# Altium project PLC_Controller Card.PrjPcb (part 2 of 2)

## Sheet Power_supply.SchDoc
size A4; SheetNumber: 7; SheetTotal: 9
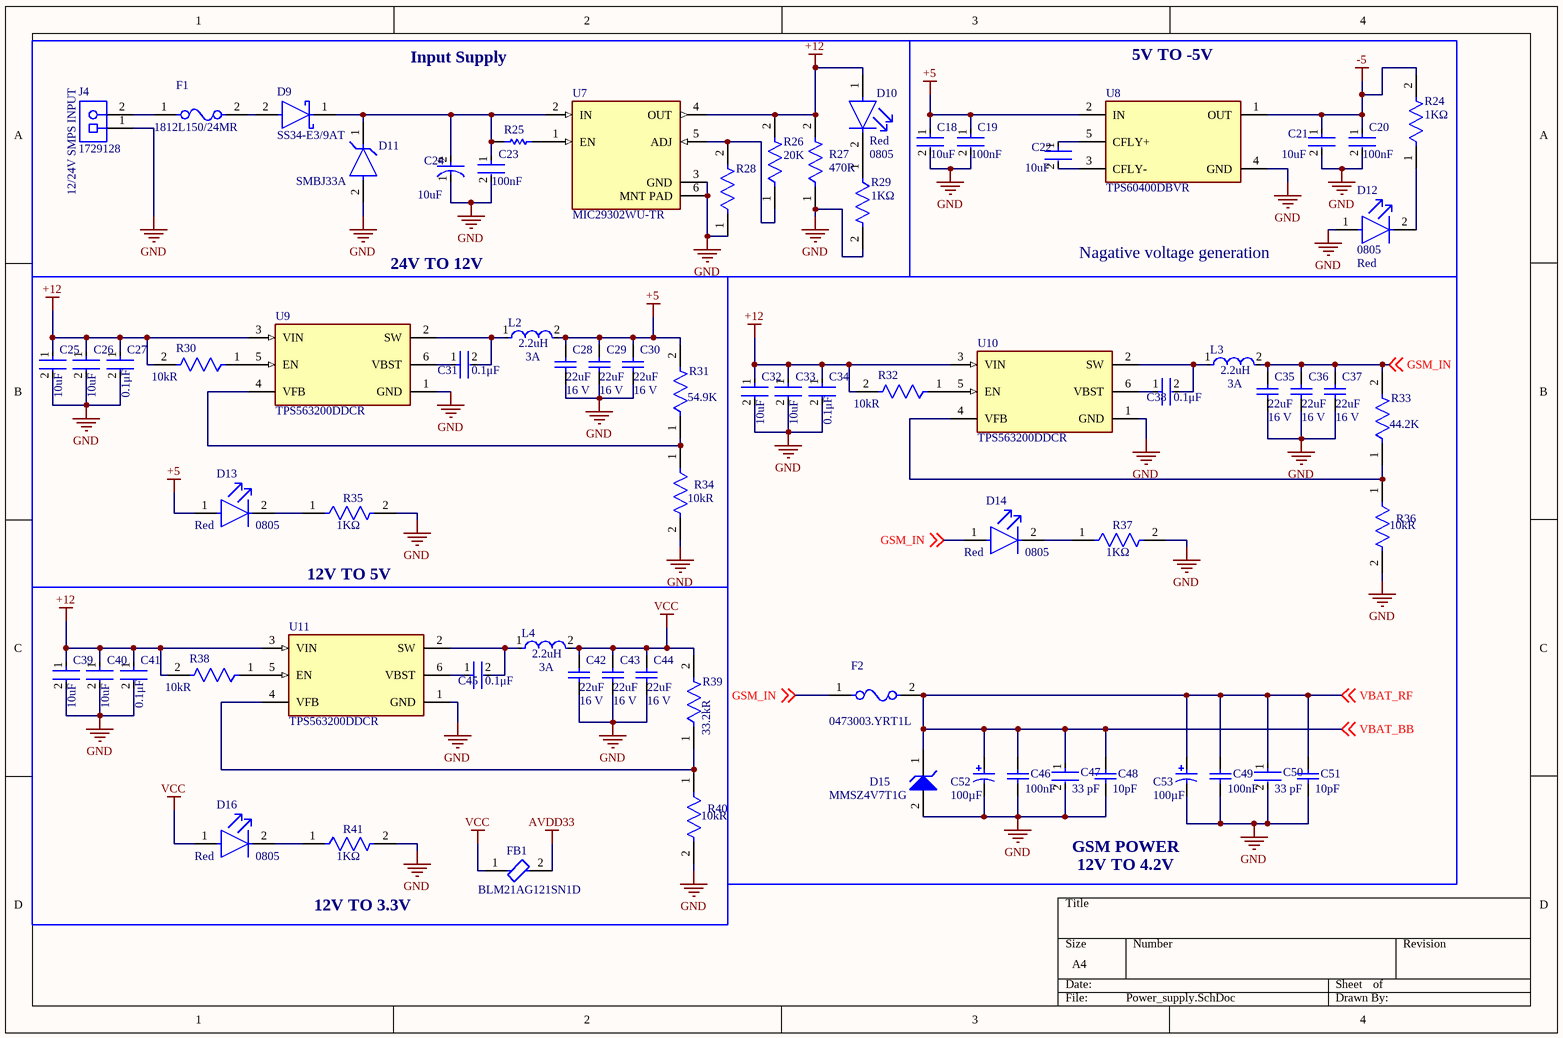
[diagram p6: Power_supply.SchDoc]

### Parts
C18  value 10uF  [FP-C0805C-DG-MFG]  (hidden comment: C0805C106K8PACTU)
C19  Capacitance: 100nF  [FP-0805-L_2_01_0_2-W_1_25-IPC_B]  (hidden comment: 08051C104K4T2A)
C20  Capacitance: 100nF  [FP-0805-L_2_01_0_2-W_1_25-IPC_B]  (hidden comment: 08051C104K4T2A)
C21  value 10uF  [FP-C0805C-DG-MFG]  (hidden comment: C0805C106K8PACTU)
C22  value 10uF  [FP-C0805C-DG-MFG]  (hidden comment: C0805C106K8PACTU)
C23  Capacitance: 100nF  [FP-0805-L_2_01_0_2-W_1_25-IPC_B]  (hidden comment: 08051C104K4T2A)
C24  Capacitance: 10uF  [FP-HAD-MFG]  (hidden comment: EEE-HA1H100P)
C25  value 10uF  [FP-C1206C-EH-MFG]  (hidden comment: C1206C106K3RACAUTO)
C26  value 10uF  [FP-C1206C-EH-MFG]  (hidden comment: C1206C106K3RACAUTO)
C27  value 0.1μF  [FP-C1206C-EB-MFG]  (hidden comment: C1206C104F3GACAUTO)
C28  value 22uF  Rated Voltage: 16 V  [CAPC1206(3216)190_L]  (hidden comment: CAP 22uF 16V 1206(3216))
C29  value 22uF  Rated Voltage: 16 V  [CAPC1206(3216)190_L]  (hidden comment: CAP 22uF 16V 1206(3216))
C30  value 22uF  Rated Voltage: 16 V  [CAPC1206(3216)190_L]  (hidden comment: CAP 22uF 16V 1206(3216))
C31  value 0.1μF  [FP-C1206C-EB-MFG]  (hidden comment: C1206C104F3GACAUTO)
C32  value 10uF  [FP-C1206C-EH-MFG]  (hidden comment: C1206C106K3RACAUTO)
C33  value 10uF  [FP-C1206C-EH-MFG]  (hidden comment: C1206C106K3RACAUTO)
C34  value 0.1μF  [FP-C1206C-EB-MFG]  (hidden comment: C1206C104F3GACAUTO)
C35  value 22uF  Rated Voltage: 16 V  [CAPC1206(3216)190_L]  (hidden comment: CAP 22uF 16V 1206(3216))
C36  value 22uF  Rated Voltage: 16 V  [CAPC1206(3216)190_L]  (hidden comment: CAP 22uF 16V 1206(3216))
C37  value 22uF  Rated Voltage: 16 V  [CAPC1206(3216)190_L]  (hidden comment: CAP 22uF 16V 1206(3216))
C38  value 0.1μF  [FP-C1206C-EB-MFG]  (hidden comment: C1206C104F3GACAUTO)
C39  value 10uF  [FP-C1206C-EH-MFG]  (hidden comment: C1206C106K3RACAUTO)
C40  value 10uF  [FP-C1206C-EH-MFG]  (hidden comment: C1206C106K3RACAUTO)
C41  value 0.1μF  [FP-C1206C-EB-MFG]  (hidden comment: C1206C104F3GACAUTO)
C42  value 22uF  Rated Voltage: 16 V  [CAPC1206(3216)190_L]  (hidden comment: CAP 22uF 16V 1206(3216))
C43  value 22uF  Rated Voltage: 16 V  [CAPC1206(3216)190_L]  (hidden comment: CAP 22uF 16V 1206(3216))
C44  value 22uF  Rated Voltage: 16 V  [CAPC1206(3216)190_L]  (hidden comment: CAP 22uF 16V 1206(3216))
C45  value 0.1μF  [FP-C1206C-EB-MFG]  (hidden comment: C1206C104F3GACAUTO)
C46  value 100nF  [CAPC1206(3216)170_L]  (hidden comment: CAP 100nF 16V 1206(3216))
C47  value 33 pF  [FP-C1206C-EB-MFG]  (hidden comment: C1206C330M4GACTU)
C48  value 10pF  [CAPC1206(3216)100_N]  (hidden comment: CAP 10pF 16V 1206(3216))
C49  value 100nF  [CAPC1206(3216)170_L]  (hidden comment: CAP 100nF 16V 1206(3216))
C50  value 33 pF  [FP-C1206C-EB-MFG]  (hidden comment: C1206C330M4GACTU)
C51  value 10pF  [CAPC1206(3216)100_N]  (hidden comment: CAP 10pF 16V 1206(3216))
C52  Capacitance: 100µF  [PNSC-EEEFK1C101P_L]  (hidden comment: EEEFK1C101P)
C53  Capacitance: 100µF  [PNSC-EEEFK1C101P_L]  (hidden comment: EEEFK1C101P)
D9  SS34-E3/9AT  [FP-SMC-MFG]
D10  Case/Package: 0805  Illumination Color: Red  [FP-SML-LX0805SRC-TR-MFG]  (hidden comment: SML-LX0805SRC-TR)
D11  SMBJ33A  [FP-SMBJ-MFG]
D12  Case/Package: 0805  Illumination Color: Red  [FP-SML-LX0805SRC-TR-MFG]  (hidden comment: SML-LX0805SRC-TR)
D13  Case/Package: 0805  Illumination Color: Red  [FP-SML-LX0805SRC-TR-MFG]  (hidden comment: SML-LX0805SRC-TR)
D14  Case/Package: 0805  Illumination Color: Red  [FP-SML-LX0805SRC-TR-MFG]  (hidden comment: SML-LX0805SRC-TR)
D15  MMSZ4V7T1G  [ONSC-SOD-123-2-425-04_V]
D16  Case/Package: 0805  Illumination Color: Red  [FP-SML-LX0805SRC-TR-MFG]  (hidden comment: SML-LX0805SRC-TR)
F1  1812L150/24MR  [FP-1812L-MFG]
F2  0473003.YRT1L  [FP-473-0]
FB1  BLM21AG121SN1D  [FP-BLM21-0_2-t0_85-e0_5-IPC_A]
J4  1729128  [PHOE-1729128-2_V]
L2  RMS Current (Irms): 3A  Inductance: 2.2uH  [FP-IFSC1515AH-MFG]  (hidden comment: IFSC1515AHER2R2M01)
L3  RMS Current (Irms): 3A  Inductance: 2.2uH  [FP-IFSC1515AH-MFG]  (hidden comment: IFSC1515AHER2R2M01)
L4  RMS Current (Irms): 3A  Inductance: 2.2uH  [FP-IFSC1515AH-MFG]  (hidden comment: IFSC1515AHER2R2M01)
R24  value 1KΩ  [FP-CRGCQ0603-IPC_C]  (hidden comment: CRGCQ0603J1K0)
R25  CRCW080551K0FKEA  [RESC2013X50X30NL20T20]  (value not drawn)
R26  Resistance: 20K  [FP-RC0805-0_6-IPC_C]  (hidden comment: 12K)
R27  Resistance: 470R  [FP-CRCW0805-HPe3-MFG]  (hidden comment: CRCW0805470RJNEAHP)
R28  CR0805-FX-4702ELF  [FP-CR0805-IPC_C]  (value not drawn)
R29  value 1KΩ  [FP-CRGCQ0603-IPC_C]  (hidden comment: CRGCQ0603J1K0)
R30  Resistance: 10kR  [FP-CRCW0603-e3-IPC_A]  (hidden comment: CRCW060310K0FKED)
R31  Resistance: 54.9K  [FP-CRCW0603-Pe3-IPC_B]  (hidden comment: CRCW060332K4FHEAP)
R32  Resistance: 10kR  [FP-CRCW0603-e3-IPC_A]  (hidden comment: CRCW060310K0FKED)
R33  Resistance: 44.2K  [FP-CRCW0603-Pe3-IPC_B]  (hidden comment: CRCW060332K4FHEAP)
R34  Resistance: 10kR  [FP-CRCW0603-e3-IPC_A]  (hidden comment: CRCW060310K0FKED)
R35  value 1KΩ  [FP-CRGCQ0603-IPC_C]  (hidden comment: CRGCQ0603J1K0)
R36  Resistance: 10kR  [FP-CRCW0603-e3-IPC_A]  (hidden comment: CRCW060310K0FKED)
R37  value 1KΩ  [FP-CRGCQ0603-IPC_C]  (hidden comment: CRGCQ0603J1K0)
R38  Resistance: 10kR  [FP-CRCW0603-e3-IPC_A]  (hidden comment: CRCW060310K0FKED)
R39  Resistance: 33.2kR  [FP-CRCW0603-Pe3-IPC_B]  (hidden comment: CRCW060332K4FHEAP)
R40  Resistance: 10kR  [FP-CRCW0603-e3-IPC_A]  (hidden comment: CRCW060310K0FKED)
R41  value 1KΩ  [FP-CRGCQ0603-IPC_C]  (hidden comment: CRGCQ0603J1K0)
U7  MIC29302WU-TR  [FP-C04-012-MFG]
U8  TPS60400DBVR  [FP-DBV0005A-IPC_C]
U9  TPS563200DDCR  [FP-DDC0006A-MFG]
U10  TPS563200DDCR  [FP-DDC0006A-MFG]
U11  TPS563200DDCR  [FP-DDC0006A-MFG]

### Nets
+5: C18.1 C19.1 C28.2 C29.2 C30.2 D13.1(A) L2.2 R31.2 U8.2(IN)
+12: C25.1 C26.1 C27.1 C32.1 C33.1 C34.1 C39.1 C40.1 C41.1 D10.1(A) R26.2 R27.2 R30.2 R32.2 R38.2 U7.4(OUT) U9.3(VIN) U10.3(VIN) U11.3(VIN)
-5: C20.1 C21.1 R24.2 U8.1(OUT)
AVDD33: FB1.2
GND: C18.2 C19.2 C20.2 C21.2 C23.2 C24.1(C) C25.2 C26.2 C27.2 C28.1 C29.1 C30.1 C32.2 C33.2 C34.2 C35.1 C36.1 C37.1 C39.2 C40.2 C41.2 C42.1 C43.1 C44.1 C46.1 C47.2 C48.1 C49.1 C50.2 C51.1 C52.2 C53.2 D11.2(A) D12.1(A) D15.2(A) J4.1 R27.1 R28.1 R29.2 R34.2 R35.2 R36.2 R37.2 R40.2 R41.2 U7.3(GND) U7.6(MNT_PAD) U8.4(GND) U9.1(GND) U10.1(GND) U11.1(GND)
VCC: C42.2 C43.2 C44.2 D16.1(A) FB1.1 L4.2 R39.2
GSM_IN: C35.2 C36.2 C37.2 D14.1(A) F2.1 L3.2 R33.2 ; off-sheet GSM_IN
VBAT_BB: C46.2 C47.1 C48.2 C49.2 C50.1 C51.2 C52.1 C53.1 D15.1(K) F2.2 ; off-sheet VBAT_RF, off-sheet VBAT_BB  [also labelled VBAT_RF]
NetC22_1: C22.1 U8.5(CFLY+)
NetC22_2: C22.2 U8.3(CFLY-)
NetC23_1: C23.1 C24.2(A) D9.1(C) D11.1(C) R25.2 U7.2(IN)
NetC31_1: C31.1 U9.6(VBST)
NetC31_2: C31.2 L2.1 U9.2(SW)
NetC38_1: C38.1 U10.6(VBST)
NetC38_2: C38.2 L3.1 U10.2(SW)
NetC45_1: C45.1 U11.6(VBST)
NetC45_2: C45.2 L4.1 U11.2(SW)
NetD9_2: D9.2(A) F1.2
NetD10_2: D10.2(C) R29.1
NetD12_2: D12.2(C) R24.1
NetD13_2: D13.2(C) R35.1
NetD14_2: D14.2(C) R37.1
NetD16_2: D16.2(C) R41.1
NetF1_1: F1.1 J4.2
NetR25_1: R25.1 U7.1(EN)
NetR26_1: R26.1 R28.2 U7.5(ADJ)
NetR30_1: R30.1 U9.5(EN)
NetR31_1: R31.1 R34.1 U9.4(VFB)
NetR32_1: R32.1 U10.5(EN)
NetR33_1: R33.1 R36.1 U10.4(VFB)
NetR38_1: R38.1 U11.5(EN)
NetR39_1: R39.1 R40.1 U11.4(VFB)

### Notes on the sheet
- Input Supply
- (near U8) 5V TO -5V
- (near J4) 12/24V SMPS INPUT
- 24V TO 12V
- Nagative voltage generation
- 12V TO 5V
- GSM POWER
- (near R41) 12V TO 3.3V
- 12V TO 4.2V
- (in symbol CMP-05427-000102-1) +

### Library data of the parts
C18 C21 C22 = CMP-2007-03243-2: CAP CER 10UF 10V X5R 0805; Manufacturer: Kemet; 3DS Part Number: 220-00001; Tolerance: 10%; Temperature Coefficient: 15%; Material: Ceramic; Device Class L2: Capacitors; Device Class L1: Passive Components; ComponentLink2URL: https://content.kemet.com/datasheets/KEM_C1006_X5R_SMD.pdf; Height: 1.4mm; Lead Free: Yes; Manufacturer Part Number: C0805C106K8PACTU; Digikey Description: CAP CER 10UF 10V X5R 0805; Octopart: https://octopart.com/c0805c106k8pactu-kemet-98697; Capacitance: 10uF; Temperature Range Low: -55°C; Temperature: -55°C to +85°C; Automotive: No; Mouser Description: CAP CER 10UF 10V X5R 0805; Ipc Land Pattern Name: CAPC200125X125; Temperature Range High: +85°C; Voltage: 10V; RoHS: TRUE; Device Class L3: Ceramic Capacitors; ComponentLink2Description: Datasheet; Voltage Rating: 10V; Package: C0805C-DG; Temperature Characteristic: X5R; Category: Cap
C19 C20 C23 = CMP-2007-04172-2: Automotive Ceramic Capacitor, 0805, 100nF, 10%, X7R, 15%, 100V; Voltage Rating (DC): 100V; Case Code (Metric): 2012; Mount: Surface Mount; Length: 2.01mm; Depth: 1.25mm; Lead Free: Lead Free; Ratings: AEC-Q200; Max Operating Temperature: 125°C; Tolerance: 10%; Case/Package: 0805; Width: 0.049inch; Package Quantity: 1; Thickness: 0.055inch; Construction: Flat; Min Operating Temperature: -55°C; REACH SVHC: No SVHC; Number of Pins: 2; Radiation Hardening: No; Voltage Rating: 100V; Height: 1.4mm; Series: -; Voltage: 100V; Dielectric: X7R; Termination: SMD/SMT; Case Code (Imperial): 0805; RoHS Compliant: Yes; Packaging: Tape and Reel; Dielectric Material: Ceramic
C24 = CMP-05427-000102-1: CAP ALUM 10UF 20% 50V SMD; Lead Diameter: 0.65mm; Ripple Current (AC): 35mA; Leakage Current: 5uA; Life (Hours): 1000Hour; Min Operating Temperature: -40°C; Series: HA; Length: 5.5mm; Radiation Hardening: No; Voltage Rating: 50V; Mount: Surface Mount; Tolerance: 20%; Ripple Current: 35mA; Lead Pitch: 1.8mm; Height: 5.4mm; Height - Seated (Max): 0.213inch; Contact Plating: Tin; Voltage Rating (DC): 50V; Diameter: 6.3mm; Voltage: 50V; Packaging: Tape and Reel; REACH SVHC: No SVHC; Case/Package: Radial; Width: 650um; Max Operating Temperature: 105°C; Lead Free: Lead Free; RoHS Compliant: Yes; Package Quantity: 1000; Termination: SMD/SMT; Construction: Cylindrical
C25 C26 C32 C33 C39 C40 = CMP-03020-004605-1: CAP CER 10UF 25V X7R 1206; Manufacturer: KEMET; Material: Ceramic; Automotive Grade: Grade 1; Temperature Coefficient: 15%; Tolerance: 10%; Manufacturer Part Number: C1206C106K3RACAUTO; Digikey Description: CAP CER 10UF 25V X7R 1206; Lead Free: Yes; Temperature Characteristic: X7R; Temperature: -55°C to +125°C; Temperature Range Low: -55°C; Octopart: https://octopart.com/c1206c106k3racauto-kemet-65707106; Temperature Range High: +125°C; RoHS: TRUE; Package: C1206C-EH; Device Class L1: Passive Components; Device Class L3: Ceramic Capacitors; Automotive: Yes; Category: Cap; ComponentLink2Description: Datasheet; Capacitance: 10uF; Height: 1.8mm; ComponentLink2URL: https://content.kemet.com/datasheets/KEM_C1023_X7R_AUTO_SMD.pdf; Voltage Rating: 25V; Device Class L2: Capacitors; Ipc Land Pattern Name: CAPC320160X160
C27 C31 C34 C38 C41 C45 = CMP-03020-009647-2: C1206 0.10 μF C0G 1.00% 25 V; Manufacturer: KEMET; Automotive Grade: Grade 0; Tolerance: 0.01; Voltage Rating: 25 V; Material: Ceramic; Temperature Coefficient: 15%; Capacitance: 0.10 μF; Device Class L3: Ceramic Capacitors; Manufacturer Part Number: C1206C104F3GACAUTO; RoHS: TRUE; Device Class L2: Capacitors; ComponentLink2Description: Datasheet; Temperature: -55°C to +150°C; Octopart: https://octopart.com/c1206c104f3gacauto-kemet-88859926; Lead Free: Yes; Temperature Range Low: -55°C; Automotive: Yes; Height: 0.88mm; Package: C1206C-EB; Temperature Range High: +150°C; Temperature Characteristic: C0G; Category: Cap; Ipc Land Pattern Name: CAPC320160X78; Device Class L1: Passive Components; ComponentLink2URL: https://content.kemet.com/datasheets/KEM_C1007_X8R_ULTRA_150C_SMD.pdf
C28-C30 C35-C37 C42-C44 = CMP-1037-04994-1: CAP 22uF 16V -20% to +80% 1206 (3216 Metric) Thickness 1.9mm SMD; Case-Metric: 3216; Case-EIA: 1206; Max Thickness: 1.9 mm; Technology: SMT; Tolerance: -20% to +80%
C46 C49 = CMP-1037-04183-1: CAP 100nF 16V ±20% 1206 (3216 Metric) Thickness 1.7mm SMD; Case-Metric: 3216; Tolerance: Â±20%; Case-EIA: 1206; Technology: SMT; Rated Voltage: 16 V; Max Thickness: 1.7 mm
C47 C50 = CMP-1037-01126-2: CAP CER 33PF 16V NP0 1206; Manufacturer: KEMET; Tolerance: 0.2; Temperature Coefficient: 15%; Automotive Grade: Grade 0; Material: Ceramic; Temperature Characteristic: C0G; Height: 0.88mm; Package: C1206C-EB; Digikey Description: CAP CER 33PF 16V NP0 1206; Device Class L1: Passive Components; ComponentLink2URL: https://content.kemet.com/datasheets/KEM_C1007_X8R_ULTRA_150C_SMD.pdf; Temperature Range High: +150°C; Temperature Range Low: -55°C; Temperature: -55°C to +150°C; Capacitance: 33 pF; Mouser Description: Multilayer Ceramic Capacitors MLCC - SMD/SMT 16volts 33pF C0G 20%; Manufacturer Part Number: C1206C330M4GACTU; Category: Cap; Ipc Land Pattern Name: CAPC320160X78; Device Class L2: Capacitors; ComponentLink2Description: Datasheet; Device Class L3: Ceramic Capacitors; Lead Free: Yes; Automotive: Yes; RoHS: TRUE; Octopart: https://octopart.com/c1206c330m4gactu-kemet-17005893; Voltage Rating: 16 V
C48 C51 = CMP-1037-00631-1: CAP 10pF 16V ±10% 1206 (3216 Metric) Thickness 1mm SMD; Case-Metric: 3216; Case-EIA: 1206; Tolerance: Â±10%; Rated Voltage: 16 V; Max Thickness: 1 mm; Technology: SMT
C52 C53 = CMP-2000-06203-1: Aluminum Electrolytic Capacitor, 100 uF, 20%, 16 V, -55 to 105 degC, 2-Pin SMD, RoHS, Tape and Reel; Manufacturer: Panasonic; Lifetime@Temperature: 2000Hrs@105°C; Impedance: 0.36O; Ripple Current: 240mA; Rated Voltage: 16V; Type: Can; Datasheet URL: http://datasheet.octopart.com/EEEFK1C101P-Panasonic-datasheet-13266987.pdf; Package Description: 2-Pin Surface Mount Device, Body 6.6 x 6.6 mm; Manufacturer URL: http://www.panasonic.com/; Case Size/Dimension: Ø6.3x5.8mm; Series: FK; Datasheet Version: 11/2012; Mounting Technology: SurfaceMount; Package Reference: EEEFK1C101P; Operating Temp-Max: 105°C; Operating Temp Range: -55to+105°C
D9 = CMP-02539-000066-1: DIODE SCHOTTKY 40V 3A DO214AB; Peak Non-Repetitive Surge Current: 100A; Forward Voltage: 500mV; Element Configuration: Single; Max Reverse Current: 500uA; Case/Package: SMC; Radiation Hardening: No; Series: -; Max Surge Current: 100A; RoHS Compliant: Yes; Min Operating Temperature: -55°C; Average Rectified Current: 3A; Max Reverse Leakage Current: 500uA; Package Quantity: 3500; Max Reverse Voltage (DC): 40V; Forward Current: 3A; Packaging: Tape and Reel; Max Operating Temperature: 125°C; Max Repetitive Reverse Voltage (Vrrm): 40V; Number of Pins: 2; Mount: Surface Mount
D10 D12-D14 D16 = CMP-57192-000013-1: LED RED CLEAR SMD; Forward Current: 20mA; Wavelength: 660nm; Forward Voltage: 1.7V; Luminous Intensity: 25mcd; Number of LEDs: 1; Current Rating: 25mA; Lens Color: Colorless; Power Rating: 100mW; Viewing Angle: 140°; Approvals: UL; Lens Transparency: Clear; Series: -; Package Quantity: 3000; Mount: Surface Mount; Lead Free: Lead Free; Max Operating Temperature: 85°C; Packaging: Tape and Reel; Length: 2mm; Lens Style: Clear; Width: 1.25mm; RoHS Compliant: Yes; Color: Red; Case Code (Metric): 2012; Dominant Wavelength: 660nm; Number of Pins: 2; Min Operating Temperature: -40°C; Case Code (Imperial): 0805; Voltage Rating (DC): 1.7V; Voltage Rating: 1.7V; Height: 1.2mm; Test Current: 20mA
D11 = CMP-2000-07095-2: TVS DIODE 33V 53.3V DO214AA; Manufacturer: Littelfuse Inc; Max Junction Temp: +150°C; Number Of Channels: 1; Breakdown Voltage: 36.7V; Peak Pulse Power: 600W; Direction: Unidirectional; Peak Pulse Current: 11.3A; Lead Free: Yes; Height: 2.61mm; Temperature Range Low: -65°C; ComponentLink2URL: https://www.littelfuse.com/~/media/electronics/datasheets/tvs_diodes/littelfuse_tvs_diode_smbj_datasheet.pdf.pdf; Manufacturer Part Number: SMBJ33A; Clamping Voltage: 53.3V; Device Class L1: Circuit Protection; Octopart: https://octopart.com/smbj33a-littelfuse-350829; Device Class L2: TVS Diodes; Digikey Description: TVS DIODE 33V 53.3V DO214AA; Automotive: No; Temperature Range High: +150°C; Package: SMBJ; ComponentLink2Description: Datasheet; Mouser Description: TVS DIODE 33V 53.3V DO214AA; Reverse Standoff Voltage: 33V; Category: Diode; Device Class L3: unset; Temperature: -65°C to +150°C; RoHS: TRUE
D15 = CMP-1060-00343-1: Zener Voltage Regulator, 500 mW, 2-Pin SOD-123, Pb-Free, Tape and Reel; Manufacturer: On Semiconductor; P Max (W): 0.5; Packing: Tape and Reel; PartNumber: MMSZ4V7T1G; PackageDescription: 2-Pin SOD, Body 1.6 x 2.69 mm; ComponentLink3URL: http://www.onsemi.com/pub_link/Collateral/425-04.PDF; ComponentLink1URL: http://www.onsemi.com/; PackageReference: SOD-123-2-425-04; ComponentLink1Description: Manufacturer URL; DatasheetVersion: Rev. 11; PackageVersion: Rev. G, 10/2009; ComponentLink2URL: http://www.onsemi.com/pub_link/Collateral/MMSZ2V4T1-D.PDF; Mounting Technology: Surface Mount; RoHS: Pb-Free; ComponentLink3Description: Package Specification; ComponentLink2Description: Datasheet
F1 = CMP-08606-000018-1: PTC RESET FUSE 24V 1.5A 1812; Manufacturer: Littelfuse Inc; Trip Current: 3A; Resistance: 0.04-0.12Ω; Current Rating: 20A; Trip Time: 1.5s; Value: 0.04-0.12Ω; Mouser Description: Resettable Fuses - PPTC 24V 1.5A-HD 40A MAX; Ipc Land Pattern Name: CAPC455324X130; Lead Free: Yes; Height: 1.8mm; RoHS: TRUE; Octopart: https://octopart.com/1812l150%2F24mr-littelfuse-7130198; Ambient Temperature Range Low: -40°C; Temperature Range High: +85°C; Automotive: No; Hold Current: 1.5A; Package: 1812L; ComponentLink2Description: Datasheet; Temperature: -40°C to +85°C; Digikey Description: PTC RESET FUSE 24V 1.5A 1812; Device Class L3: unset; ComponentLink2URL: https://www.littelfuse.com/~/media/electronics/datasheets/resettable_ptcs/littelfuse_ptc_1812l_datasheet.pdf.pdf; Voltage Rating: 24V; Device Class L2: PTC Resettable Fuses; Device Class L1: Circuit Protection; Temperature Range Low: -40°C; Manufacturer Part Number: 1812L150/24MR; Category: Fuse; Ambient Temperature Range High: +85°C
F2 = CMP-08605-000017-1: FUSE BRD MNT 3A 125VAC/VDC AXIAL; Manufacturer: Littelfuse; Value: 0.0380Ω; Fuse Blow Speed: Slow; Max Fuse Dc Voltage: 125V; Fuse Interrupt Ac Current: 50A; Fuse I2T: 21A2Sec; ComponentLink2Description: Datasheet; Lead Free: Yes; Octopart: https://octopart.com/0473003.yrt1l-littelfuse-561109; RoHS: TRUE; Mouser Description: Fuses with Leads (Through Hole) 125V 3A Slo-Blo; Automotive: No; Digikey Description: FUSE BRD MNT 3A 125VAC/VDC AXIAL; Max Fuse Ac Voltage: 125V; Device Class L3: unset; Temperature: -60°C to +125°C; Category: Fuse; Height: 3.43mm; Package: 473; Manufacturer Part Number: 0473003.YRT1L; Resistance: 0.0380Ω; Ipc Land Pattern Name: CAPAD1039W80L711D343; Temperature Range High: +125°C; Temperature Range Low: -60°C; Fuse Interrupt Dc Current: 50A; Fuse Current: 3A; ComponentLink2URL: https://www.littelfuse.com/~/media/electronics/datasheets/fuses/littelfuse_fuse_473_datasheet.pdf.pdf; Device Class L2: Fuses; Device Class L1: Circuit Protection
FB1 = CMP-0686-00716-3: FERRITE BEAD 120 OHM 0805 1LN; Number of Lines: 1; DC Resistance-Max: 100mR; Material: Steel; Max DC Current: 200mA; Shielding: Unshielded; Test Frequency: 100MHz; Impedance: 120R; Current Rating: 800mA; Max Current Rating: 1A; Resistance: 150mR; Tolerance: 25%; Width: 1.25mm; Number of Circuits: 1; Military Standard: Not; Height: 0.85mm; Series: BLM21A; Min Operating Temperature: -55°C; DC Resistance (DCR): 100mR; Termination: SMD/SMT; Core Material: Ferrite; REACH SVHC: No SVHC; Radiation Hardening: No; Max Operating Temperature: 125°C; Number of Pins: 2; Case/Package: 0805; Case Code (Imperial): 0805; Frequency: 100MHz; Depth: 1.25mm; Length: 2mm; DC Current: 200mA; Lead Free: Lead Free; Case Code (Metric): 2012; Package Quantity: 1; Packaging: Tape and Reel
J4 = CMP-2000-05815-1: PCB Terminal Block, 13.5 A, 400 V, 2-Pin THD, RoHS, Bulk; Manufacturer: Phoenix Contact; Package Version: 03/2015; No. of Rows: 1; Pitch: 5.08mm; No. of Positions: 2; Voltage Rating: 400V; Current Rating: 13500mA; Manufacturer URL: http://www.phoenixcontact.com/; Datasheet URL: https://datasheet.ciiva.com/16046/1729128-16046181.pdf; RoHS: TRUE; Package URL: https://www.phoenixcontact.com/online/portal/pi/pxc/product_detail_page/!ut/p/b1/3VdJjqNKFDxLH8AFycySyWY2ozFsEPOMMQaDOX1XedGL_1Vdm5YXJleknhSKeBkvI6EA8ncAo3AYoDhBQGco6KN7VURTdemj9us_IEKEZo_YHiPAEWEFmDGOHMORkqKYCORBZxgL7ZoaZYcbFFUZ3fqxSY6GOuxydWUuHqz1ynmMFygu583Bob0Ewr6Sd_l-5m-kAueHiB0jpRwZwe58wwtkpxtMYd_LmGcDRU02dRNEyWt6Y2ti5pSyJ_reIkzIulrqApdnbT11V5jnCKbYNCvhEM1MCpPByat_X379-iThf08CI5GfOPqfBeS3BRoBOdD55AKVv0iLwCMq-2BrzXWSGRH7pUGD9uwXQjiph3xL0DKQwdGa0JImiIOmBNOestqgwTHSSs2oOep-78apyXQBvNi8ZLaFjvjWvcaUEBu0MC6Wbe-d6mB0FAebo2lUWinqYaZs5DAYzV0RP9yitUjnGJ0iI9xhZkT42OCQNUJJhkgWINNQLP2JFP6OpMg3JCVg70jqHT0lvKOnhHf0lPuOnnLf0VPuWx6_dxwUIvwk5WMkT0kLL1mh61l2yZVSzG3pYV_bqo-mj6uMKwKwdnnW8Jh5RTOJzMOA5c-eJDaZQw4mTMPH02PvS_ZAqNVjVTo2WyYLkwH_KU1mmmG5kjRhDqPXLwwVHvVOjCM60-fpXvTDfMGW1PVFVS1r4e4yVDk4ZdNbkUHvqPqQSeian4UD39fNKmachqdJ1NJbyk8rXT9mXTvPk3oE5meulKGgiruPJek-4I9hTT6G8ZLOyRSm2RRVbThERQad5OS28hdt4YW4vG0stgYYzsWsK4_7y6DZMjJSCqri1kyiZR5vD7pwIrNR7QwPHTcLTI5qT7eRlpHrdGiupYlqQDJ7zy_CND8fWWBoLRXxk1RVcXiBQwbTD4Xi7KL-FuO94t9xaqweXzH; PartNumber: 1729128; Package Description: 2-Pin Through Hole Device, Body 8.1 x 10.16 mm, Pitch 5.08 mm; Datasheet Version: 12/2013; Mounting Technology: ThroughHole; Orientation: Horizontal; Package Reference: 1729128-2; Packing: Bulk
L2-L4 = CMP-02424-000690-1: FIXED IND 2.2UH 3A 45 MOHM SMD; Test Frequency: 100kHz; Inductance Tolerance: 20%; Shielding: Shielded; DC Resistance (DCR): 45mR; Package Quantity: 2000; Max Operating Temperature: 125°C; Termination: SMD/SMT; Length: 4mm; Lead Free: Lead Free; Saturation Current: 3A; Width: 3.8mm; Current Rating: 3A; Mount: Surface Mount; Tolerance: 20%; Height - Seated (Max): 0.075inch; RoHS Compliant: Yes; Max DC Current: 3A; Case/Package: 1515; Height: 1.8mm; Depth: 4mm; Series: IFSC-1515AH-01; Min Operating Temperature: -55°C; Contact Plating: Tin; Packaging: Tape and Reel; Number of Pins: 2; Military Standard: Not
R24 R29 R35 R37 R41 = CMP-03211-006828-1: CRGCQ 0603 1K0 5%; Manufacturer: TE Connectivity; Temperature Coefficient: ±100ppm/°C; Tolerance: 0.05; Power Rating: 0.1W; Voltage Rating: 75V; Temperature: -55°C to +155°C; Height: 0.55mm; Resistance: 1KΩ; Lead Free: Yes; Device Class L1: Passive Components; Manufacturer Part Number: CRGCQ0603J1K0; Device Class L3: Chip SMD Resistors; Series: CRGCQ; Octopart: https://octopart.com/crgcq0603j1k0-te+connectivity-91018104; Category: Res; RoHS: TRUE; Temperature Range High: +155°C; Digikey Description: CRGCQ 0603 1K0 5%; Ambient Temperature Range High: +70°C; ComponentLink2Description: Datasheet; Device Class L2: Resistors; Package: CRGCQ0603; Ipc Land Pattern Name: RESC16080X45; Temperature Range Low: -55°C; ComponentLink2URL: https://www.te.com/commerce/DocumentDelivery/DDEController?Action=showdoc&DocId=Data+Sheet%7F1773204-3%7F1%7Fpdf%7FEnglish%7FENG_DS_1773204-3_1.pdf%7F4-2176339-695; Composition: Thick Film
R25 = CMP-2001-03993-1: Manufacturer: Vishay Dale; Value: 51K; Part Number: CRCW080551K0FKEA
R26 = CMP-2100-03668-5: RES 100K OHM 1% 1/8W 0805; Power Rating: 125mW; Temperature Coefficient: 100ppm/°C; Voltage Rating (DC): 150V; Package Quantity: 1; Case/Package: 0805; Lead Pitch: 0.4mm; Case Code (Imperial): 0805; Construction: Rectangular; Number of Terminations: 2; RoHS Compliant: Yes; Max Power Dissipation: 125mW; Tolerance: 1%; Max Operating Temperature: 155°C; Resistance Tolerance: 1%; Lead Free: Lead Free; Packaging: Tape and Reel; Resistor Type: Thick Film; Min Operating Temperature: -55°C; Case Code (Metric): 2012; Series: RC; Technology: THICK FILM; Voltage Rating: 150V; Termination: SMD/SMT; Width: 0.049inch; Number of Pins: 2; Features: Moisture Resistant; Military Standard: Not; Length: 0.079inch; Depth: 1.25mm; Size Code: 0805; Height: 0.024inch
R27 = CMP-2001-04210-2: RES Thick Film, 470Ω, 5%, 0.5W, 200ppm/°C, 0805; Max Power Dissipation: 333mW; Voltage Rating: 150V; Power Rating: 330mW; Termination: SMD/SMT; Radiation Hardening: No; Max Operating Temperature: 155°C; Packaging: Tape and Reel; Composition: Thick Film; Tolerance: 5%; Length: 0.079inch; Weight: 0.000194oz; Temperature Coefficient: 200ppm/°C; Height: 0.024inch; Number of Terminations: 2; Min Operating Temperature: -55°C; Lead Free: Lead Free; Case Code (Metric): 2012; Width: 1.2mm; Case Code (Imperial): 0805; Case/Package: 0805; Package Quantity: 1; Contact Plating: Tin; Features: Automotive AEC-Q200
R28 = CMP-07231-004291-1: Thick Film Chip Resistors 0805 47kΩ 0.125W 1% 100ppm/°C; Voltage Rating (DC): 150V; Power Rating: 125mW; Number of Pins: 2; Length: 2mm; Case/Package: 0805; Thickness: 508um; Composition: Thick Film; Tolerance: 1%; Package Quantity: 5000; Case Code (Metric): 2012; Packaging: Tape and Reel; Termination: SMD/SMT; Military Standard: Not; Voltage Rating: 150V; Temperature Coefficient: 100ppm/°C; Case Code (Imperial): 0805; Height: 0.5mm; Radiation Hardening: No; Contact Plating: Tin; Min Operating Temperature: -55°C; Mount: Surface Mount; Depth: 1.25mm; Max Operating Temperature: 155°C; REACH SVHC: No SVHC; Width: 1.25mm
R30 R32 R34 R36 R38 R40 = CMP-02407-003273-1: RES Thick Film, 10kΩ, 1%, 0.1W, 100ppm/°C, 0603; Max Power Dissipation: 100mW; Tolerance: 1%; Packaging: Tape and Reel; Lead Free: Lead Free; Max Operating Temperature: 155°C; Min Operating Temperature: -55°C; Package Quantity: 10000; Length: 0.061inch; Height: 0.02inch; Width: 0.033inch; Composition: Thick Film; Number of Terminations: 2; Case/Package: 0603; Features: Automotive AEC-Q200; Temperature Coefficient: 100ppm/°C
R31 R33 R39 = CMP-03613-000206-1: RES Thick Film, 32.4kΩ, 1%, 0.1W, 50ppm/°C, 0603; Max Power Dissipation: 100mW; Max Operating Temperature: 155°C; Length: 0.061inch; RoHS Compliant: Yes; Width: 0.033inch; Packaging: Tape and Reel; Temperature Coefficient: 50ppm/°C; Features: Automotive AEC-Q200; Case/Package: 0603; Series: CRCW-P; Number of Terminations: 2; Package Quantity: 5000; Tolerance: 1%; Resistor Type: Thick Film; Height: 0.02inch; Min Operating Temperature: -55°C
U7 = CMP-06324-000007-1: IC REG LINEAR POS ADJ 3A TO263-5; Manufacturer: Microchip; Output Voltage: 3.3-12V; Output Type: AdjustableProgrammable; Max Junction Temp: +125°C; Standoff Height: 0mm; Accuracy Percentage: 1%; Max Supply Voltage: 26V; Nominal Supply Current: 10-37mA; Number Of Outputs: 1; Dropout Voltage: 370mV; Min Supply Voltage: 2.25V; ComponentLink2URL: http://ww1.microchip.com/downloads/en/DeviceDoc/MIC2915x-30x-50x-75x-High-Current-Low-Dropout-Regulators-DS20005685B.pdf; Device Class L1: Integrated Circuits (ICs); Digikey Description: IC REG LINEAR POS ADJ 3A TO263-5; Device Class L2: Power Management ICs; Lead Free: Yes; Mouser Description: LDO Voltage Regulators; Package: C04-012; Temperature: -40°C to +125°C; ComponentLink2Description: Datasheet; Temperature Range High: +125°C; Automotive: No; Device Class L3: Voltage Regulators - Linear; Category: IC; Temperature Range Low: -40°C; RoHS: TRUE; Output Current: 3A; Octopart: https://octopart.com/mic29302wu-tr-microchip-66801318; Manufacturer Part Number: MIC29302WU-TR; Height: 0.2inch
U8 = CMP-0391-00019-3: IC REG CHARG PUMP INV 60MA SOT23; Number of Outputs: 1; Min Supply Voltage: 1.8V; Max Supply Voltage: 5.25V; Max Output Voltage: -5.25V; Operating Supply Current: 125uA; Logic Function: Inverting; Min Output Voltage: -1.6V; Output Type: Adjustable; Switching Frequency: 250kHz; Synchronous Rectifier: No; Min Operating Temperature: -40°C; Number of Pins: 5; Package Quantity: 3000; Min Input Voltage: 1.8V; Max Operating Temperature: 85°C; Packaging: Tape and Reel; Output Current: 60mA; Max Input Voltage: 5.25V; Weight: 0.000459oz; Lead Free: Lead Free; Output Voltage: -5.25V; Contact Plating: Gold; Radiation Hardening: No; Quiescent Current: 125uA; Max Output Current: 60mA; REACH SVHC: No SVHC; Case/Package: SOT-23-5
U9-U11 = CMP-04918-000155-1: IC REG BUCK ADJ 3A TSOT23-6; Quiescent Current: 190uA; Output Voltage: 7V; Min Input Voltage: 4.5V; Output Configuration: Positive; Number of Outputs: 1; Switching Frequency: 650kHz; Synchronous Rectifier: Yes; Min Output Voltage: 760mV; Output Type: Adjustable; Operating Supply Voltage: 17V; Max Operating Temperature: 125°C; Lead Free: Lead Free; Packaging: Tape and Reel; Radiation Hardening: No; Mount: Surface Mount; Contact Plating: Tin; Output Current: 3A; Max Output Voltage: 7V; Min Operating Temperature: -40°C; Case/Package: SOT-23-6; Max Output Current: 3A; Max Input Voltage: 17V

## Sheet SIM CARD.SchDoc: Title
size A4; Date: *******; ApprovedBy: *******; CheckedBy: None; Author: *******; CompanyName: *******; DrawnBy: Name; Engineer: *******; Organization: *******; Address1: *******; Address2: *******; Address3: *******; Address4: *******; DocumentNumber: 4; Revision: *******; SheetNumber: 8; SheetTotal: 9; CurrentTime: *******; CurrentDate: *******; Time: *******; DocumentFullPathAndName: *******; DocumentName: *******; ModifiedDate: *******; ImagePath: *******; ProjectName: *******; Application_BuildNumber: *******
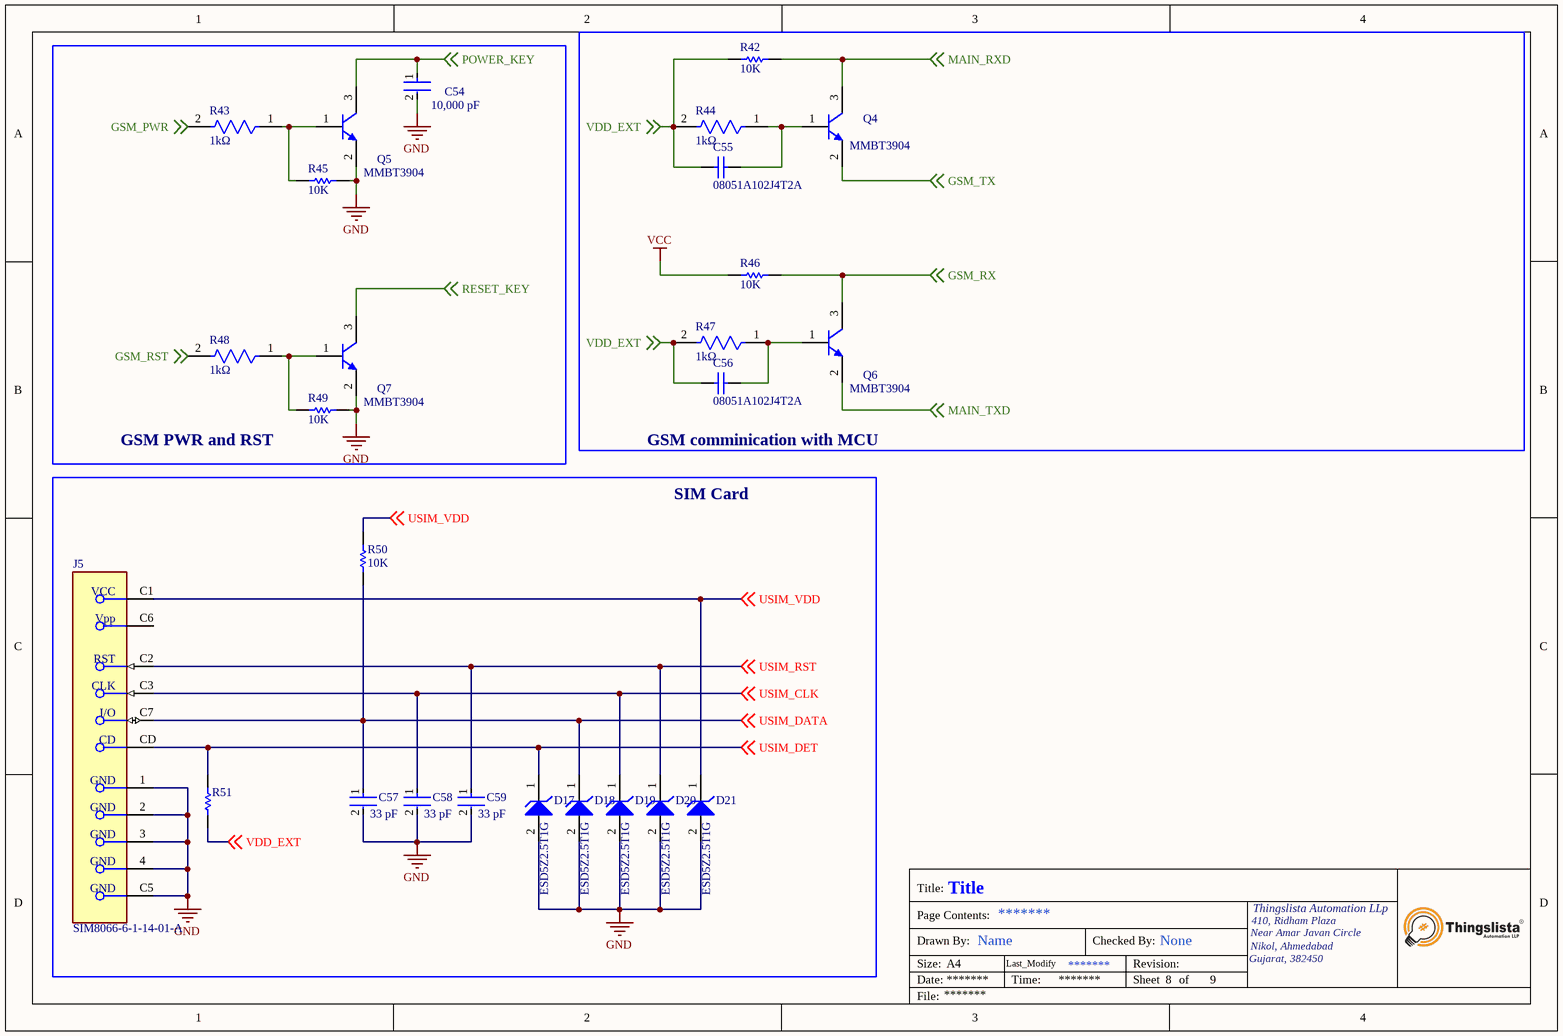
[diagram p7: SIM CARD.SchDoc]

### Parts
C54  value 10,000 pF  [FP-C0805C-DN-MFG]  (hidden comment: C0805C103K2RACTU)
C55  08051A102J4T2A  [CAPC2013X94X50NL20T25]
C56  08051A102J4T2A  [CAPC2013X94X50NL20T25]
C57  value 33 pF  [FP-C1206C-EB-MFG]  (hidden comment: C1206C330M4GACTU)
C58  value 33 pF  [FP-C1206C-EB-MFG]  (hidden comment: C1206C330M4GACTU)
C59  value 33 pF  [FP-C1206C-EB-MFG]  (hidden comment: C1206C330M4GACTU)
D17  ESD5Z2.5T1G  [ONSC-SOD-523-2-502-01_V]
D18  ESD5Z2.5T1G  [ONSC-SOD-523-2-502-01_V]
D19  ESD5Z2.5T1G  [ONSC-SOD-523-2-502-01_V]
D20  ESD5Z2.5T1G  [ONSC-SOD-523-2-502-01_V]
D21  ESD5Z2.5T1G  [ONSC-SOD-523-2-502-01_V]
J5  SIM8066-6-1-14-01-A  [FP-SIM8066-6-1-14-01-A-MFG]
Q4  MMBT3904  [FAIR-SOT23-3_V]
Q5  MMBT3904  [FAIR-SOT23-3_V]
Q6  MMBT3904  [FAIR-SOT23-3_V]
Q7  MMBT3904  [FAIR-SOT23-3_V]
R42  value 10K  [RESC2013X60X35NL10T20]  (hidden comment: RC0805FR-0710KL)
R43  Resistance: 1kΩ  [FP-CRG0805-IPC_A]  (hidden comment: CRG0805F1K0)
R44  Resistance: 1kΩ  [FP-CRG0805-IPC_A]  (hidden comment: CRG0805F1K0)
R45  value 10K  [RESC2013X60X35NL10T20]  (hidden comment: RC0805FR-0710KL)
R46  value 10K  [RESC2013X60X35NL10T20]  (hidden comment: RC0805FR-0710KL)
R47  Resistance: 1kΩ  [FP-CRG0805-IPC_A]  (hidden comment: CRG0805F1K0)
R48  Resistance: 1kΩ  [FP-CRG0805-IPC_A]  (hidden comment: CRG0805F1K0)
R49  value 10K  [RESC2013X60X35NL10T20]  (hidden comment: RC0805FR-0710KL)
R50  value 10K  [RESC2013X60X35NL10T20]  (hidden comment: RC0805FR-0710KL)
R51  CRCW080551K0FKEA  [RESC2013X50X30NL20T20]  (value not drawn)

### Blocks framed on the sheet
GSM PWR and RST: C54 Q5 Q7 R43 R45 R48 R49
GSM comminication with MCU: C55 C56 Q4 Q6 R42 R44 R46 R47
SIM Card: C57-C59 D17-D21 J5 R50 R51

### Nets
GND: C54.2 C57.2 C58.2 C59.2 D17.2(A) D18.2(A) D19.2(A) D20.2(A) D21.2(A) J5.1(GND) J5.2(GND) J5.3(GND) J5.4(GND) J5.C5(GND) Q5.2(E) Q7.2(E) R45.1 R49.1
VCC: R46.2
GSM_PWR: R43.2 ; off-sheet GSM_PWR
GSM_RST: R48.2 ; off-sheet GSM_RST
GSM_RX: Q6.3(C) R46.1 ; off-sheet GSM_RX
GSM_TX: Q4.2(E) ; off-sheet GSM_TX
MAIN_RXD: Q4.3(C) R42.1 ; off-sheet MAIN_RXD
MAIN_TXD: Q6.2(E) ; off-sheet MAIN_TXD
POWER_KEY: C54.1 Q5.3(C) ; off-sheet POWER_KEY
RESET_KEY: Q7.3(C) ; off-sheet RESET_KEY
USIM_CLK: C58.1 D19.1(K) J5.C3(CLK) ; off-sheet USIM_CLK
USIM_DATA: C57.1 D18.1(K) J5.C7(I/O) R50.2 ; off-sheet USIM_DATA
USIM_DET: D17.1(K) J5.CD R51.2 ; off-sheet USIM_DET
USIM_RST: C59.1 D20.1(K) J5.C2(RST) ; off-sheet USIM_RST
USIM_VDD: D21.1(K) J5.C1(VCC) R50.1 ; off-sheet USIM_VDD
VDD_EXT: C55.1 C56.1 R42.2 R44.2 R47.2 R51.1 ; off-sheet VDD_EXT
NetC55_2: C55.2 Q4.1(B) R44.1
NetC56_2: C56.2 Q6.1(B) R47.1
NetQ5_1: Q5.1(B) R43.1 R45.2
NetQ7_1: Q7.1(B) R48.1 R49.2

Not connected (* = marked no-connect by the designer): J5 C6(Vpp)

### Notes on the sheet
- Title:
- Page Contents:
- 410, Ridham Plaza
- Thingslista Automation LLp
- Size:
- Date:
- File:
- Drawn By:
- A4
- Last_Modify
- Time:
- Checked By:
- Revision:
- Sheet
- of
- Gujarat, 382450
- Near Amar Javan Circle
- Nikol, Ahmedabad

### Library data of the parts
C54 = CMP-2007-00259-2: CAP CER 10000PF 200V X7R 0805; Manufacturer: KEMET; Material: Ceramic; Temperature Coefficient: 30ppm/°C; Tolerance: 0.1; Device Class L2: Capacitors; Voltage Rating: 200 V; Temperature Range High: +125°C; ComponentLink2Description: Datasheet; Height: 0.88mm; Octopart: https://octopart.com/c0805c103k2ractu-kemet-9138347; ComponentLink2URL: https://content.kemet.com/datasheets/KEM_C1003_C0G_SMD.pdf; Capacitance: 10,000 pF; Category: Cap; Temperature: -55°C to +125°C; Temperature Range Low: -55°C; Digikey Description: CAP CER 10000PF 200V X7R 0805; Manufacturer Part Number: C0805C103K2RACTU; Temperature Characteristic: X7R; Automotive: No; Device Class L3: Ceramic Capacitors; Mouser Description: KEMET - C0805C103K2RACTU - CAP, MLCC, X7R, 10NF, 200V, 0805; RoHS: TRUE; Device Class L1: Passive Components; Lead Free: Yes; Package: C0805C-DN; Ipc Land Pattern Name: CAPC200125X78
C55 C56 = CMP-2007-04125-1: Manufacturer: AVX Interconnect / Elco; Part Number: 08051A102J4T2A
C57-C59 = CMP-1037-01126-2: as C47 on sheet Power_supply; Height: 0.88mm; Package: C1206C-EB; Digikey Description: CAP CER 33PF 16V NP0 1206; Device Class L1: Passive Components; ComponentLink2URL: https://content.kemet.com/datasheets/KEM_C1007_X8R_ULTRA_150C_SMD.pdf; Temperature Range High: +150°C; Temperature Range Low: -55°C; Temperature: -55°C to +150°C; Capacitance: 33 pF; Mouser Description: Multilayer Ceramic Capacitors MLCC - SMD/SMT 16volts 33pF C0G 20%; Manufacturer Part Number: C1206C330M4GACTU; Category: Cap; Ipc Land Pattern Name: CAPC320160X78; Device Class L2: Capacitors; ComponentLink2Description: Datasheet; Device Class L3: Ceramic Capacitors; Lead Free: Yes; Automotive: Yes; RoHS: TRUE; Octopart: https://octopart.com/c1206c330m4gactu-kemet-17005893; Voltage Rating: 16 V
D17-D21 = CMP-1063-00103-1: Transient Voltage Suppressor, Micro-Packaged Diode for ESD Protection, 2-Pin SOD-523, Pb-Free, Tape and Reel; Manufacturer: On Semiconductor; Direction: Unidirectional; PPK Max (W): 120; V(BR) Min (V): 4; VRWM Max (V): 2.5; Number of Lines: 1; IR Max (uA): 6; ComponentLink3Description: Package Specification; Packing: Tape and Reel; ComponentLink2URL: http://www.onsemi.cn/pub_link/Collateral/ESD5Z2.5T1-D.PDF; ComponentLink3URL: http://www.onsemi.com/pub_link/Collateral/502-01.PDF; PackageReference: SOD-523-2-502-01; PartNumber: ESD5Z2.5T1G; Mounting Technology: Surface Mount; DatasheetVersion: Rev. 10; PackageVersion: Rev. E, 09/2010; RoHS: Pb-Free; ComponentLink1Description: Manufacturer URL; PackageDescription: 2-Pin SOD, Body 1.2 x 0.8 mm; ComponentLink2Description: Datasheet; ComponentLink1URL: http://www.onsemi.com/
J5 = CMP-03329-117635865-1: SIM8066-6-1-14-01-A Memory Card Connectors 1.44mm Nano SIM Conn w/Peg and Switch; Current Rating: 1A; Number of Contacts: 6; Voltage Rating: 30V; NexarPartId: 117635865; Number of Pins: 6; Min Operating Temperature: -40°C; Max Operating Temperature: 85°C; Contact Material: Gold, Nickel
Q4-Q7 = CMP-1670-00008-1: NPN General Purpose Amplifier, 40 V, 0.2 A, -55 to 150 degC, 3-Pin SOT23, RoHS, Tape and Reel; Tolerance: 30ppm; Capacitance: 1.8E-11 f; Frequency: 12.288 MHz; ESR: 40 Ohm; Load Capacitance: 18 pF; REACH SVHC: No SVHC; Pins: 4; ComponentLink3URL: http://www.fairchildsemi.com/dwg/MA/MA03D.pdf; PackageDescription: 3-Pin Small Outline Transistor, Body 2.92 x 1.325 mm, Pitch 0.95 mm; ComponentLink1URL: https://www.fairchildsemi.com/; Max Operating Temperature: 70degC; PackageReference: SOT23-3; ComponentLink1Description: Manufacturer URL; Width: 0.126 inch; Min Operating Temperature: -20degC; DatasheetVersion: Rev. 1.1.0, 10/2014; Mount: Surface Mount; Height: 0.041 inch; Package Quantity: 1000; Frequency Tolerance: 30ppm; Packaging: Tape and Reel; ComponentLink2URL: https://www.fairchildsemi.com/datasheets/MM/MMBT3904.pdf; RoHSCompliant: True; ComponentLink3Description: Package Specification; ComponentLink2Description: Datasheet; Length: 0.197 inch
R42 R45 R46 R49 R50 = CMP-1659-00013-4: Chip Resistor, 10 KOhm, +/- 1%, 0.125 W, -55 to 155 degC, 0805 (2012 Metric), RoHS, Tape and Reel; Manufacturer: Yageo; Voltage Rating: 150 V; Mount: Surface Mount; ComponentLink1Description: Manufacturer URL; ComponentLink2URL: http://www.yageo.com/documents/recent/PYu-RC_Group_51_RoHS_L_04.pdf; Pins: 2; Length: 2 mm; Min Operating Temperature: -55 degC; Height: 0.5 mm; Mounting Technology: Surface Mount; RoHSCompliant: true; REACH SVHC: No SVHC; ComponentLink1URL: http://www.yageo.com/; Max Operating Temperature: 155 degC; PackageReference: 0805; DatasheetVersion: Rev. 4, 02/2016; Package Quantity: 5000; Packaging: Tape and Reel; ComponentLink2Description: Datasheet; PackageDescription: 2-Pin Surface Mounted Device, Body 2 x 1.25 mm
R43 R44 R47 R48 = CMP-03790-16077480-1: CRG0805F1K0 Thick Film Resistors - SMD 1K Ohm 1% 1/8W Res Thick Film 0805; Manufacturer Lifecycle Status: ACTIVE; Max Power Dissipation: 125mW; Voltage Rating: 150V; Number of Resistors: 1; Temperature Coefficient: 100ppm/°C; ELV: Compliant; Case/Package: 0805; Number of Terminations: 2; Termination: SMD/SMT, Solder; Composition: Thick Film; Voltage Rating (DC): 150V; Min Operating Temperature: -55°C; Tolerance: 1%; Case Code (Imperial): 0805; Power Rating: 125mW; Schedule B: 8533210045, 8533210090, 8533210090; Case Code (Metric): 2012; NexarPartId: 16077480; Packaging: Tape and Reel; Lifecycle Status: Production; Depth: 1.25mm; Mount: Surface Mount; Weight: 5.499807mg; Radiation Hardening: No; Max Operating Temperature: 125°C; Width: 1.2446mm; Length: 2mm; Military Standard: Not; RoHS: Compliant; Height: 550µm
R51 = CMP-2001-03993-1: Manufacturer: Vishay Dale; Value: 51K; Part Number: CRCW080551K0FKEA

## Nets that join several sheets
+5: Communication_with_IO (P1.10), MCU (J7.1), Peripherals (P6.1 R16.2 U4.16), Power_supply (9 pins)
-5: Communication_with_IO (P1.12), Power_supply (C20.1 C21.1 R24.2 U8.1)
AVDD33: MCU (5 pins), Power_supply (FB1.2)
GND: Communication_with_IO (P2.20 P3.14), GSM (44 pins), ANT (7 pins), GSM_INDICATION (7 pins), MCU (34 pins), Peripherals (24 pins), Power_supply (51 pins), SIM CARD (18 pins)
VCC: Communication_with_IO (P2.19), ANT (C3.2 L1.2), MCU (15 pins), Peripherals (11 pins), Power_supply (7 pins), SIM CARD (R46.2)
485_CTRL: MCU (U2.65), Peripherals (D6.1 U4.4 U4.5)
485_DI: MCU (U2.63), Peripherals (D7.1 U4.6)
485_RO: MCU (U2.64), Peripherals (D8.1 U4.3)
A_IOUT_CS: Communication_with_IO (P1.9), MCU (U2.51)
A_IOUT_LDAC: Communication_with_IO (P1.3), MCU (U2.41)
A_IOUT_SHDN: Communication_with_IO (P1.1), MCU (U2.42)
A_OUT_MOSI: Communication_with_IO (P1.5 P1.15), MCU (U2.32)
A_OUT_SCLK: Communication_with_IO (P1.7 P1.17), MCU (U2.30)
A_VOUT_CS: Communication_with_IO (P1.19), MCU (U2.29)
A_VOUT_LDAC: Communication_with_IO (P1.13), MCU (U2.43)
A_VOUT_SHDN: Communication_with_IO (P1.11), MCU (U2.44)
ANALOG_INPUT1: Communication_with_IO (P1.2), MCU (U2.33)
ANALOG_INPUT2: Communication_with_IO (P1.4), MCU (U2.34)
ANALOG_INPUT3: Communication_with_IO (P1.6), MCU (U2.35)
ANALOG_INPUT4: Communication_with_IO (P1.8), MCU (U2.36)
ANT_GNSS: GSM (U1.47), ANT (C4.1)
ANT_MAIN: GSM (U1.49), ANT (R2.2)
CS_SD: MCU (U2.57), Peripherals (J3.2)
DIGITAL_INPUT1: Communication_with_IO (P2.1), MCU (U2.1)
DIGITAL_INPUT2: Communication_with_IO (P2.2), MCU (U2.2)
DIGITAL_INPUT3: Communication_with_IO (P2.3), MCU (U2.25)
DIGITAL_INPUT4: Communication_with_IO (P2.4), MCU (U2.26)
DIGITAL_INPUT5: Communication_with_IO (P2.5), MCU (U2.4)
DIGITAL_INPUT6: Communication_with_IO (P2.6), MCU (U2.98)
DIGITAL_INPUT7: Communication_with_IO (P2.7), MCU (U2.37)
DIGITAL_INPUT8: Communication_with_IO (P2.8), MCU (U2.16)
DIGITAL_INPUT9: Communication_with_IO (P2.9), MCU (U2.90)
DIGITAL_INPUT10: Communication_with_IO (P2.10), MCU (U2.91)
DIGITAL_INPUT11: Communication_with_IO (P2.11), MCU (U2.92)
DIGITAL_INPUT12: Communication_with_IO (P2.12), MCU (U2.93)
DIGITAL_INPUT13: Communication_with_IO (P2.13), MCU (U2.95)
DIGITAL_INPUT14: Communication_with_IO (P2.14), MCU (U2.96)
DIGITAL_INPUT15: Communication_with_IO (P2.15), MCU (U2.47)
DIGITAL_INPUT16: Communication_with_IO (P2.16), MCU (U2.48)
DIGITAL_INPUT17: Communication_with_IO (P2.17), MCU (U2.3)
DIGITAL_INPUT18: Communication_with_IO (P2.18), MCU (U2.97)
DIGITAL_OUTPUT1: Communication_with_IO (P3.6), MCU (U2.40)
DIGITAL_OUTPUT2: Communication_with_IO (P3.5), MCU (U2.39)
DIGITAL_OUTPUT3: Communication_with_IO (P3.4), MCU (U2.38)
DIGITAL_OUTPUT4: Communication_with_IO (P3.3), MCU (U2.5)
DIGITAL_OUTPUT5: Communication_with_IO (P3.2), MCU (U2.81)
DIGITAL_OUTPUT6: Communication_with_IO (P3.1), MCU (U2.82)
DIGITAL_OUTPUT7: Communication_with_IO (P3.9), MCU (U2.83)
DIGITAL_OUTPUT8: Communication_with_IO (P3.8), MCU (U2.84)
DIGITAL_OUTPUT9: Communication_with_IO (P3.10), MCU (U2.85)
DIGITAL_OUTPUT10: Communication_with_IO (P3.12), MCU (U2.86)
DIGITAL_OUTPUT11: Communication_with_IO (P3.11), MCU (U2.87)
DIGITAL_OUTPUT12: Communication_with_IO (P3.7), MCU (U2.88)
E_CS: MCU (U2.15), Peripherals (U3.5)
E_INT: MCU (U2.55), Peripherals (U3.6)
E_MISO: MCU (U2.79), Peripherals (U3.7)
E_MOSI: MCU (U2.80), Peripherals (U3.3)
E_RST: MCU (U2.7), Peripherals (U3.8)
E_SCLK: MCU (U2.78), Peripherals (U3.4)
F_CS: MCU (U2.60), Peripherals (U6.1)
F_MISO: MCU (U2.53), Peripherals (J3.7 U6.2)
F_MOSI: MCU (U2.54), Peripherals (J3.3 U6.5)
F_RESET: MCU (U2.56), Peripherals (U6.7)
F_SCLK: MCU (U2.52), Peripherals (J3.5 U6.6)
GSM_PWR: MCU (U2.58), SIM CARD (R43.2)
GSM_RST: MCU (U2.59), SIM CARD (R48.2)
GSM_RX: MCU (U2.69), SIM CARD (Q6.3 R46.1)
GSM_TX: MCU (U2.68), SIM CARD (Q4.2)
IO_BOARD_SCL: MCU (U2.67), Peripherals (R20.1 U5.2)
IO_BOARD_SDA: MCU (U2.66), Peripherals (R19.1 U5.3)
MAIN_RXD: GSM (U1.68), SIM CARD (Q4.3 R42.1)
MAIN_TXD: GSM (U1.67), SIM CARD (Q6.2)
NET_MODE: GSM (U1.5), GSM_INDICATION (R5.2)
NET_STATUS: GSM (U1.6), GSM_INDICATION (R11.2)
POWER_KEY: GSM (U1.21), SIM CARD (C54.1 Q5.3)
RESET_KEY: GSM (U1.20), SIM CARD (Q7.3)
STATUS: GSM (U1.61), GSM_INDICATION (R6.2)
USIM_CLK: GSM (U1.16), SIM CARD (C58.1 D19.1 J5.C3)
USIM_DATA: GSM (U1.15), SIM CARD (C57.1 D18.1 J5.C7 R50.2)
USIM_DET: GSM (U1.13), SIM CARD (D17.1 J5.CD R51.2)
USIM_RST: GSM (U1.17), SIM CARD (C59.1 D20.1 J5.C2)
USIM_VDD: GSM (U1.14), SIM CARD (D21.1 J5.C1 R50.1)
VBAT_BB: GSM (U1.57 U1.58 U1.59 U1.60), GSM_INDICATION (D1.1 D2.1 D3.1 D4.1), Power_supply (10 pins)
VDD_EXT: GSM (U1.7), SIM CARD (6 pins)